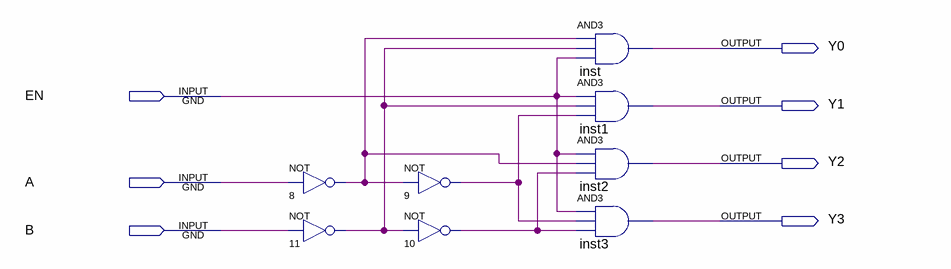
[diagram p0: schematic sheet]
// Quartus schematic DECODER.bdf as structural Verilog: 8 symbols, 7 pins
module DECODER (
  input  EN,
  input  A,
  input  B,
  output Y0,
  output Y1,
  output Y2,
  output Y3
);

  wire n8_out, n9_out, n10_out, n11_out;

  not u_8 (n8_out, A);
  not u_11 (n11_out, B);
  not u_9 (n9_out, n8_out);
  not u_10 (n10_out, n11_out);
  and inst (Y0, n8_out, n11_out, EN);
  and inst1 (Y1, EN, n11_out, n9_out);
  and inst2 (Y2, EN, n8_out, n10_out);
  and inst3 (Y3, EN, n9_out, n10_out);
endmodule
